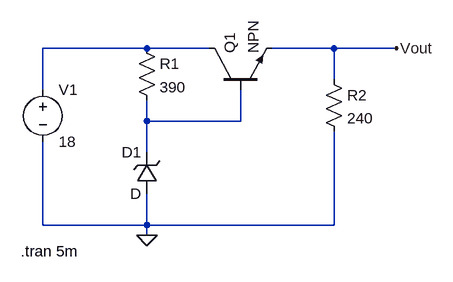
[diagram p0: schematic Draft1.asc]
Draft1.asc, the LTspice schematic file:
Version 4
SHEET 1 880 680
WIRE 208 48 48 48
WIRE 304 48 208 48
WIRE 496 48 400 48
WIRE 592 48 496 48
WIRE 496 96 496 48
WIRE 48 112 48 48
WIRE 208 160 208 128
WIRE 352 160 352 112
WIRE 352 160 208 160
WIRE 208 208 208 160
WIRE 48 320 48 192
WIRE 208 320 208 272
WIRE 208 320 48 320
WIRE 496 320 496 176
WIRE 496 320 208 320
WIRE 208 336 208 320
FLAG 208 336 0
FLAG 592 48 Vout
SYMBOL voltage 48 96 R0
WINDOW 123 0 0 Left 0
WINDOW 39 0 0 Left 0
SYMATTR InstName V1
SYMATTR Value 18
SYMBOL res 192 32 R0
SYMATTR InstName R1
SYMATTR Value 390
SYMBOL res 480 80 R0
SYMATTR InstName R2
SYMATTR Value 240
SYMBOL zener 224 272 R180
WINDOW 0 24 64 Left 2
WINDOW 3 24 0 Left 2
SYMATTR InstName D1
SYMBOL npn3 304 112 R270
SYMATTR InstName Q1
TEXT 14 360 Left 2 !.tran 5m

The netlist it stands for:
* Draft1.asc
V1 N001 0 18
R1 N001 N002 390
R2 Vout 0 240
D1 0 N002 D
Q1 N001 N002 Vout 0 NPN
.model D D
.lib standard.dio
.model NPN NPN
.model PNP PNP
.lib standard.bjt
.tran 5m
.backanno
.end